# Altium schematic sheet MAZ000162 - Diagrama físico.SchDoc: MAZ000162 - Diagrama físico
size A; ApprovedBy: Christian Ledwidth; CheckedBy: Nahuel Martinez; Author: Santiago Marti; CompanyName: Body Health; DrawnBy: Santiago Marti; Revision: A; SheetNumber: 2; SheetTotal: 2
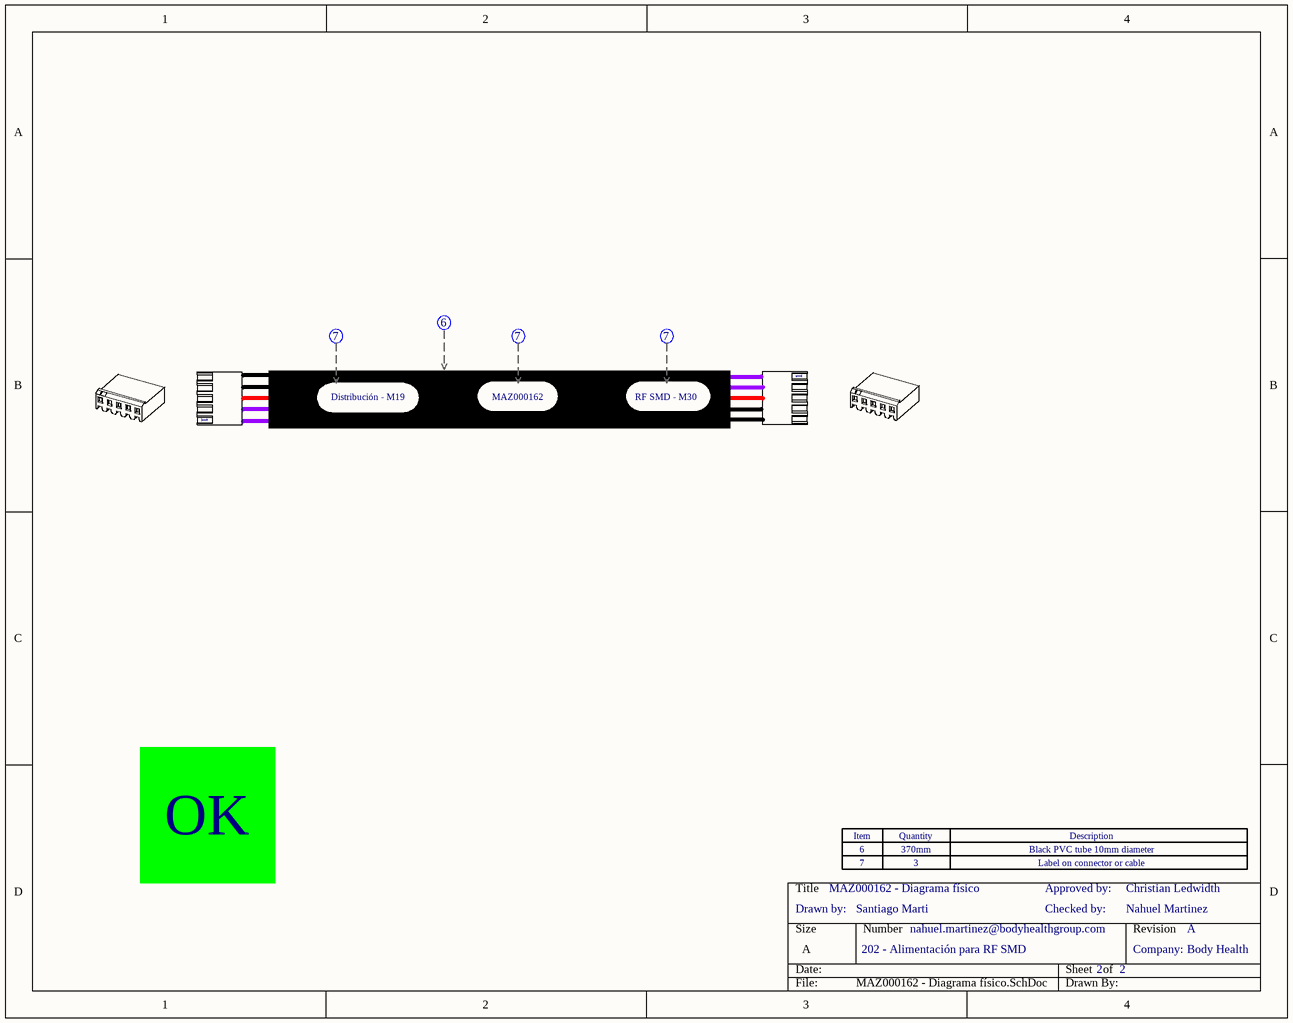
[diagram p0: MAZ000162 - Diagrama físico.SchDoc]

## Parts
Con1  SL156-5  (value not drawn)  (parts A,B of 4)
Con2  SL156-5  (value not drawn)  (parts A,B of 4)
Soc1  sock_SL156_770476-1  (value not drawn)  (part A of 2)
Soc2  sock_SL156_770476-1  (value not drawn)  (part A of 2)
Soc3  sock_SL156_770476-1  (value not drawn)  (part A of 2)
Soc4  sock_SL156_770476-1  (value not drawn)  (part A of 2)
Zoc1  Zócalo_Header  (value not drawn)
Zoc2  Zócalo_Item  (value not drawn)
Zoc3  Zócalo_Item  (value not drawn)

## Notes on the sheet
- Distribución - M19
- MAZ000162
- RF SMD - M30
- OK
- Drawn by:
- 6
- 7
- 370mm
- 3
- Checked by:
- Approved by:
- Black PVC tube 10mm diameter
- Label on connector or cable
- 202 - Alimentación para RF SMD
- nahuel.martinez@bodyhealthgroup.com
- Company:
- (in symbol Zócalo_Header) Item; Quantity; Description

## Library data of the parts
Con1 Con2 = SL156-5: CONN RECEPT 5 POS W/RAMP SL-156; Cod.Fabricante: 640250-5; Fabricante: TE Connectivity AMP Connectors; Cod.DigiKey: A19953-ND; ComponentLink1Description: Manufacturer Link; ComponentLink1URL: https://www.te.com/commerce/DocumentDelivery/DDEController?Action=srchrtrv&DocNm=640250&DocType=Customer+Drawing&DocLang=English; DIGIKEYx50: 0.19420; CallOut: *; DIGIKEYx100: 0.18660
Soc1 = sock_SL156_770476-1: CONN SOCKET 18-24AWG CRIMP TIN; Fabricante: TE Connectivity AMP Connectors; CallOut: 6; Cod.DigiKey: A19993CT-ND; Cod.Fabricante: 770476-1; ComponentLink1Description: Manufacturer Link; ComponentLink1URL: https://www.te.com/commerce/DocumentDelivery/DDEController?Action=srchrtrv&DocNm=770476&DocType=Customer+Drawing&DocLang=English; DIGIKEYx100: 0.08690; DIGIKEYx50: 0.08180
Soc2-Soc4 = sock_SL156_770476-1: CONN SOCKET 18-24AWG CRIMP TIN; Fabricante: TE Connectivity AMP Connectors; CallOut: 7; Cod.DigiKey: A19993CT-ND; Cod.Fabricante: 770476-1; ComponentLink1Description: Manufacturer Link; ComponentLink1URL: https://www.te.com/commerce/DocumentDelivery/DDEController?Action=srchrtrv&DocNm=770476&DocType=Customer+Drawing&DocLang=English; DIGIKEYx100: 0.08690; DIGIKEYx50: 0.08180
Zoc1 = Zócalo_Header: Header para el zócalo de referencias
Zoc2 Zoc3 = Zócalo_Item: Ítem para el zócalo de referencias; Desginator: *; Quantity: *; ItemDescription: *